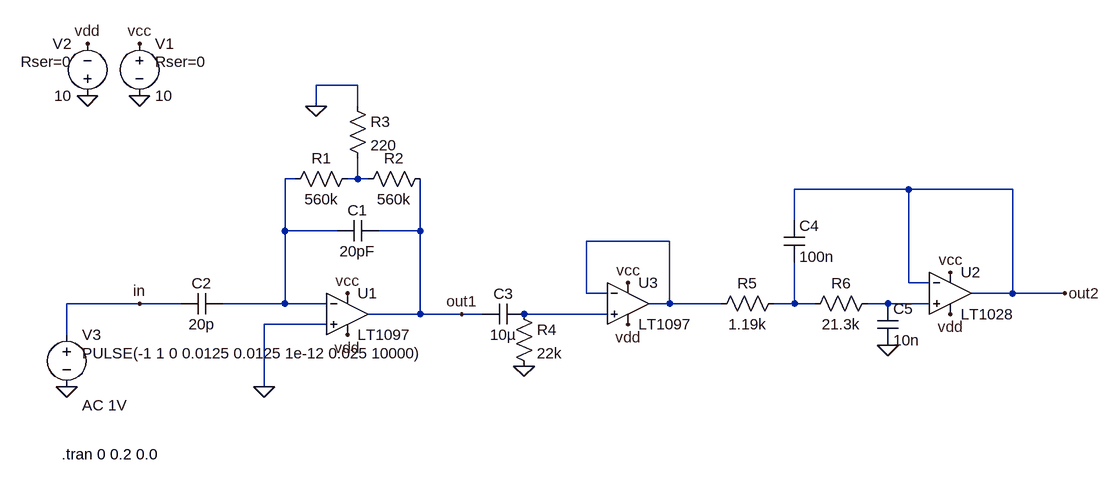
[diagram p0: schematic preampSim.asc]
preampSim.asc, the LTspice schematic file:
Version 4
SHEET 1 1356 680
WIRE 192 -224 128 -224
WIRE 128 -192 128 -224
WIRE 192 -192 192 -224
WIRE 96 -80 80 -80
WIRE 192 -80 192 -112
WIRE 192 -80 176 -80
WIRE 208 -80 192 -80
WIRE 1040 -64 864 -64
WIRE 1200 -64 1040 -64
WIRE 864 -16 864 -64
WIRE 80 0 80 -80
WIRE 160 0 80 0
WIRE 288 0 288 -80
WIRE 288 0 224 0
WIRE 672 16 544 16
WIRE 1040 80 1040 -64
WIRE 1072 80 1040 80
WIRE 544 96 544 16
WIRE 576 96 544 96
WIRE 1200 96 1200 -64
WIRE 1200 96 1136 96
WIRE 1280 96 1200 96
WIRE -144 112 -256 112
WIRE -80 112 -144 112
WIRE 80 112 80 0
WIRE 80 112 -16 112
WIRE 144 112 80 112
WIRE 672 112 672 16
WIRE 672 112 640 112
WIRE 752 112 672 112
WIRE 864 112 864 48
WIRE 864 112 832 112
WIRE 896 112 864 112
WIRE 1008 112 976 112
WIRE 1072 112 1008 112
WIRE 288 128 288 0
WIRE 288 128 208 128
WIRE 352 128 288 128
WIRE 384 128 352 128
WIRE 576 128 448 128
WIRE 144 144 48 144
WIRE -256 160 -256 112
WIRE 48 240 48 144
FLAG 48 240 0
FLAG 128 -192 0
FLAG -144 112 in
FLAG 352 128 out1
FLAG 176 96 vcc
FLAG 176 160 vdd
FLAG -144 -208 0
FLAG -224 -208 0
FLAG -144 -288 vcc
FLAG -224 -288 vdd
FLAG -256 240 0
FLAG 448 208 0
FLAG 1008 176 0
FLAG 1280 96 out2
FLAG 608 80 vcc
FLAG 1104 64 vcc
FLAG 608 144 vdd
FLAG 1104 128 vdd
SYMBOL Opamps\\LT1097 176 64 R0
SYMATTR InstName U1
SYMBOL cap 224 -16 R90
WINDOW 0 0 32 VBottom 2
WINDOW 3 32 32 VTop 2
SYMATTR InstName C1
SYMATTR Value 20pF
SYMBOL res 192 -96 R90
WINDOW 0 0 56 VBottom 2
WINDOW 3 32 56 VTop 2
SYMATTR InstName R1
SYMATTR Value 560k
SYMBOL res 304 -96 R90
WINDOW 0 0 56 VBottom 2
WINDOW 3 32 56 VTop 2
SYMATTR InstName R2
SYMATTR Value 560k
SYMBOL res 176 -208 R0
SYMATTR InstName R3
SYMATTR Value 220
SYMBOL cap -16 96 R90
WINDOW 0 0 32 VBottom 2
WINDOW 3 32 32 VTop 2
SYMATTR InstName C2
SYMATTR Value 20p
SYMATTR SpiceLine V=30 Rser=0 Lser=0
SYMBOL voltage -144 -304 R0
WINDOW 123 0 0 Left 2
WINDOW 39 24 44 Left 2
SYMATTR SpiceLine Rser=0
SYMATTR InstName V1
SYMATTR Value 10
SYMBOL voltage -224 -192 R180
WINDOW 0 24 96 Left 2
WINDOW 3 24 16 Left 2
WINDOW 123 0 0 Left 2
WINDOW 39 24 68 Left 2
SYMATTR InstName V2
SYMATTR Value 10
SYMATTR SpiceLine Rser=0
SYMBOL voltage -256 144 R0
WINDOW 3 24 44 Left 2
WINDOW 123 24 124 Left 2
WINDOW 39 0 0 Left 2
SYMATTR Value PULSE(-1 1 0 0.0125 0.0125 1e-12 0.025 10000)
SYMATTR Value2 AC 1V
SYMATTR InstName V3
SYMBOL cap 448 112 R90
WINDOW 0 0 32 VBottom 2
WINDOW 3 32 32 VTop 2
SYMATTR InstName C3
SYMATTR Value 10µ
SYMATTR SpiceLine V=25 Irms=8.06 Rser=0.00577565 Lser=0 mfg="KEMET" pn="C1210C106K3PAC" type="X5R"
SYMBOL res 432 112 R0
SYMATTR InstName R4
SYMATTR Value 22k
SYMBOL Opamps\\LT1097 608 48 R0
SYMATTR InstName U3
SYMBOL res 848 96 R90
WINDOW 0 0 56 VBottom 2
WINDOW 3 32 56 VTop 2
SYMATTR InstName R5
SYMATTR Value 1.19k
SYMBOL res 992 96 R90
WINDOW 0 0 56 VBottom 2
WINDOW 3 32 56 VTop 2
SYMATTR InstName R6
SYMATTR Value 21.3k
SYMBOL cap 848 -16 R0
SYMATTR InstName C4
SYMATTR Value 100n
SYMATTR SpiceLine V=16 Irms=1.94 Rser=0.0650466 Lser=0
SYMBOL cap 992 112 R0
SYMATTR InstName C5
SYMATTR Value 10n
SYMATTR SpiceLine V=25 Irms=134m Rser=1.77579 Lser=0
SYMBOL Opamps\\LT1028 1104 32 R0
SYMATTR InstName U2
TEXT -264 344 Left 2 !.tran 0 0.2 0.0

The netlist it stands for:
* preampSim.asc
XU1 0 N001 vcc vdd out1 LT1097  ; pins In+ In- V+ V- OUT
C1 out1 N001 20pF
R1 N002 N001 560k
R2 out1 N002 560k
R3 0 N002 220
C2 N001 in 20p V=30 Rser=0 Lser=0
V1 vcc 0 10 Rser=0
V2 0 vdd 10 Rser=0
V3 in 0 PULSE(-1 1 0 0.0125 0.0125 1e-12 0.025 10000) AC 1V
C3 N006 out1 10µ V=25 Irms=8.06 Rser=0.00577565 Lser=0 mfg="KEMET" pn="C1210C106K3PAC" type="X5R"
R4 N006 0 22k
XU3 N006 N003 vcc vdd N003 LT1097  ; pins In+ In- V+ V- OUT
R5 N004 N003 1.19k
R6 N005 N004 21.3k
C4 out2 N004 100n V=16 Irms=1.94 Rser=0.0650466 Lser=0
C5 N005 0 10n V=25 Irms=134m Rser=1.77579 Lser=0
XU2 N005 out2 vcc vdd out2 LT1028  ; pins In+ In- V+ V- OUT
.tran 0 0.2 0.0
.lib LTC.lib
.backanno
.end